# Altium schematic sheet Voltage Regulator.SchDoc
size A
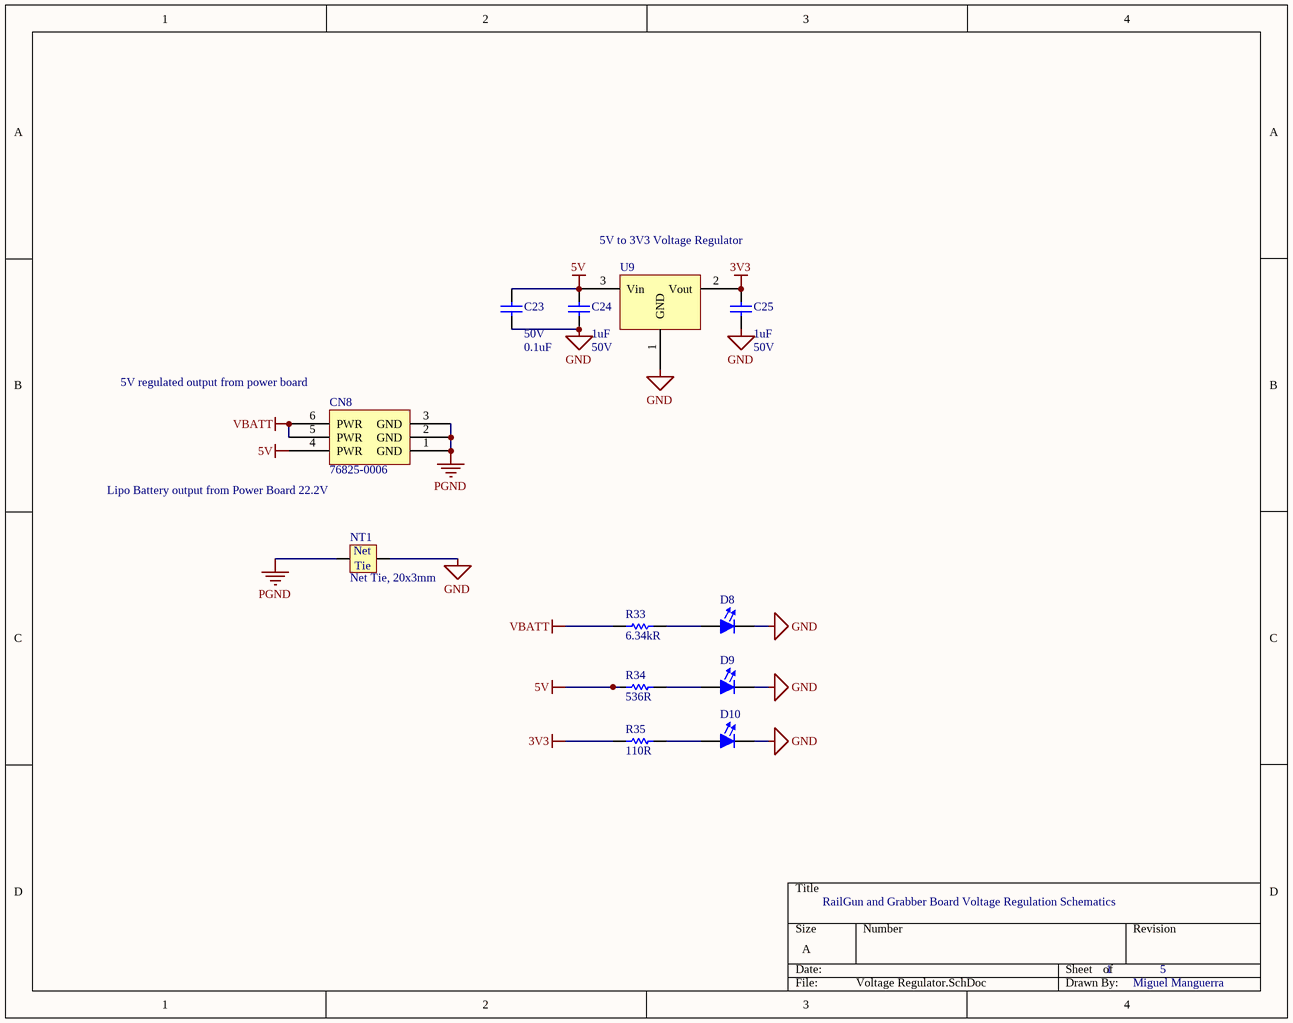
[diagram p0: Voltage Regulator.SchDoc]

## Parts
C23  Voltage: 50V  Capacitance: 0.1uF  [FP-CL10-0_1-MFG]  (hidden comment: CL10B104JB8NNNC)
C24  Capacitance: 1uF  Voltage: 50V  [0803 CAP]  (hidden comment: CL21B105KBFNNNG)
C25  Capacitance: 1uF  Voltage: 50V  [0803 CAP]  (hidden comment: CL21B105KBFNNNG)
CN8  76825-0006  [76825-0006-Footprint-1]
D8  LT Q39G-Q1OO-25-1  [FP-LB_Q39E-MFG]  (value not drawn)
D9  LT Q39G-Q1OO-25-1  [FP-LB_Q39E-MFG]  (value not drawn)
D10  LT Q39G-Q1OO-25-1  [FP-LB_Q39E-MFG]  (value not drawn)
NT1  Net Tie, 20x3mm  [NETTIE_20x3mm]  (net tie, no BOM)
R33  6.34kR  [RESC1609X50X30NL10T20]
R34  536R  [RESC1608X55X30LL15T15]
R35  110R  [RESC1608X55X25ML10T15]
U9  3.3V 250mA Linear Reg LDO  [SOT95P245X110-3N]  (value not drawn)

## Nets
3V3: C25.1 R35.1 U9.2(Vout)
5V: C23.1 C24.1 CN8.4(PWR) R34.1 U9.3(Vin)
GND: C23.2 C24.2 C25.2 D8.1(Cathode) D9.1(Cathode) D10.1(Cathode) NT1.2 U9.1(GND)
PGND: CN8.1(GND) CN8.2(GND) CN8.3(GND) NT1.1
VBATT: CN8.5(PWR) CN8.6(PWR) R33.1
NetD8_2: D8.2(Anode) R33.2
NetD9_2: D9.2(Anode) R34.2
NetD10_2: D10.2(Anode) R35.2

## Notes on the sheet
- 5V to 3V3 Voltage Regulator
- (near CN8) 5V regulated output from power board
- (near CN8) Lipo Battery output from Power Board 22.2V
- RailGun and Grabber Board Voltage Regulation Schematics
- 1
- 5
- Miguel Manguerra
- (in symbol CMP-053-0007-2) Net; Tie

## Library data of the parts
C23 = CMP-00000-3: CAP CER 0.1UF 50V X7R 0603; Tolerance: 5%; Material: Ceramic; Case Code (Imperial): 0603; Mount: Surface Mount; Thickness: 0.035inch; Depth: 0.8mm; Packaging: Tape and Reel; Package Quantity: 1; Dielectric: X7R; Height: 0.8mm; Radiation Hardening: No; Max Operating Temperature: 125°C; Voltage Rating: 50V; Case/Package: 0603; Min Operating Temperature: -55°C; Case Code (Metric): 1608; Length: 1.6mm; Contact Plating: Tin; Width: 0.031inch
C24 C25 = CMP-00005-1: SAMSUNG ELECTRO-MECHANICS - CL21B105KBFNNNG - MLCC CAPACITORS; Tolerance: 10%; Material: Ceramic; Dielectric: X7R; Case/Package: 0805; Voltage Rating: 50V; Contact Plating: Tin; Max Operating Temperature: 125°C; Termination: Wraparound; Package Quantity: 3000; Depth: 1.25mm; Mount: Surface Mount; Min Operating Temperature: -55°C; Thickness: 0.053inch; Packaging: Tape and Reel; Case Code (Metric): 2012; Length: 2mm; Case Code (Imperial): 0805; Width: 0.049inch
CN8 = CMP-00049-2: CONNECTOR, HEADER, 6POS, 2ROW, 5.7MM; Product Range:Mega-Fit 76825 Series; Contact Termination Type:Through Hole; Gender:Header; No. of Contacts:6; Pitch Spacing:5.7mm; Contact Plating:Tin Plated Contacts; Contact Material:Copper; Gender: Male; Number of Circuits: 6; REACH SVHC: Unknown; Termination: Through Hole; Orientation: Right Angle; Number of Rows: 2; Color: Black; Contact Plating: Tin; Contact Material: Copper; Number of Contacts: 6; Pitch: 5.7mm; Number of Pins: 6; Mount: Through Hole
D8-D10 = CMP-00064-3: LED GREEN DIFFUSED 0603 SMD; Dominant Wavelength: 530nm; Luminous Intensity: 280mcd; Lens Style: Diffused,Colorless,Rectangular; Number of LEDs: 1; Forward Voltage: 2.85V; Test Current: 5mA; Reverse Voltage: 5V; Forward Current: 15mA; Luminous Flux: 0.55lm; Radiation Hardening: No; Packaging: Tape and Reel; Mount: Surface Mount; Color: Green; Max Operating Temperature: 85°C; Number of Elements: 1; Number of Pins: 2; Min Operating Temperature: -40°C; Depth: 0.9mm; Case/Package: SMD/SMT; Length: 1.7mm
NT1 = CMP-053-0007-2: Size: 20mmx3mm; Date Created: 2016-06-17; Source: AUVic_Integrated_Library_Virtual_Components.SchLib; Pin Count: 2; Created By: Ashwin Sira; Design Item ID: Net Tie, 20x3mm; Component Type: Net Tie; Publisher: AUVic
R33 = CMP-00072-1: VISHAY         CRCW06036K34FKEA.             SMD Chip Resistor, Thick Film, 6.34 kohm, 75 V, 0603 [1608 Metric], 100 mW,  1%, CRCW Series; Temperature Coefficient: 100ppm/°C; Voltage Rating: 75V; Power Rating: 100mW; Resistance: 6.34kR; Depth: 0.85mm; Military Standard: Not; Case Code (Imperial): 0603; Composition: Thick Film; Packaging: Tape and Reel; Width: 0.033inch; Termination: SMD/SMT; Length: 1.55mm; Case/Package: 0603; Height: 0.45mm; Contact Plating: Tin; Features: Automotive AEC-Q200; Case Code (Metric): 1608; Min Operating Temperature: -55°C; Package Quantity: 10; REACH SVHC: Unknown; Radiation Hardening: No; Max Operating Temperature: 155°C; Tolerance: 1%; Number of Terminations: 2; Weight: 7.1E-05oz; Max Power Dissipation: 100mW; Number of Pins: 2
R34 = CMP-00071-1: SMD Chip Resistor, 0603 [1608 Metric], 536 ohm, ERJ3EK Series, 75 V, Thick Film, 100 mW; Tolerance: 1%; Voltage Rating (DC): 50V; Voltage Rating: 75V; Power Rating: 100mW; Temperature Coefficient: 100ppm/°C; Max Operating Temperature: 155°C; Package Quantity: 1; REACH SVHC: No SVHC; Depth: 0.8mm; Composition: Thick Film; Height: 0.022inch; Packaging: Tape and Reel; Contact Plating: Tin; Lead Free: Lead Free; Length: 1.6mm; Case/Package: 0603; Military Standard: Not; Features: Automotive AEC-Q200; Resistance: 536R; Termination: SMD/SMT; Max Power Dissipation: 100mW; Width: 0.8mm; Mount: Surface Mount; Case Code (Metric): 1608; Case Code (Imperial): 0603; Number of Terminations: 2; Min Operating Temperature: -55°C
R35 = CMP-00069-1: RES SMD 110 OHM 1% 1/10W 0603; Max Power Dissipation: 100mW; Voltage Rating (DC): 50V; Temperature Coefficient: 100ppm/°C; Working Voltage: 75V; Military Standard: Not; Termination: SMD/SMT; Number of Terminations: 2; Features: Moisture Resistant; Min Operating Temperature: -55°C; Power Rating: 100mW; Height: 0.022inch; Package Quantity: 1; Lead Free: Lead Free; Tolerance: 1%; Voltage Rating: 50V; Resistance: 110R; Composition: Thick Film; Case Code (Imperial): 0603; Length: 1.6mm; Packaging: Tape and Reel; Case Code (Metric): 1608; Max Operating Temperature: 155°C; Depth: 0.8mm; Case/Package: 0603; Width: 0.031inch
U9 = CMP-00003-1: IC REG LINEAR 3.3V 250MA SOT23-3; Max Input Voltage: 6.6V; Accuracy: 2%; Polarity: Positive; Number of Outputs: 1; Output Type: Fixed; Dropout Voltage: 400mV; Quiescent Current: 1uA; Min Input Voltage: 2.5V; Min Operating Temperature: -40°C; Supplier 1: Digi-Key; Supplier Part Number 1: AP2138N-3.3TRG1; Width: 1.7mm; Length: 3.02mm; Height: 1.3mm; Output Current: 250mA; Created By: Poorna Chander Kalidas; Number of Regulators: 1; Number of Pins: 3; Package Quantity: 3000; Date Created: June 26, 2020; Output Voltage: 3.3V; Max Operating Temperature: 85°C; Max Output Current: 250mA; Weight: 0.000282oz; Packaging: Tape and Reel; Lead Free: Lead Free; Mount: Surface Mount; Case/Package: SOT-23-3